# Altium project mb1367.PrjPcb (part 1 of 3)
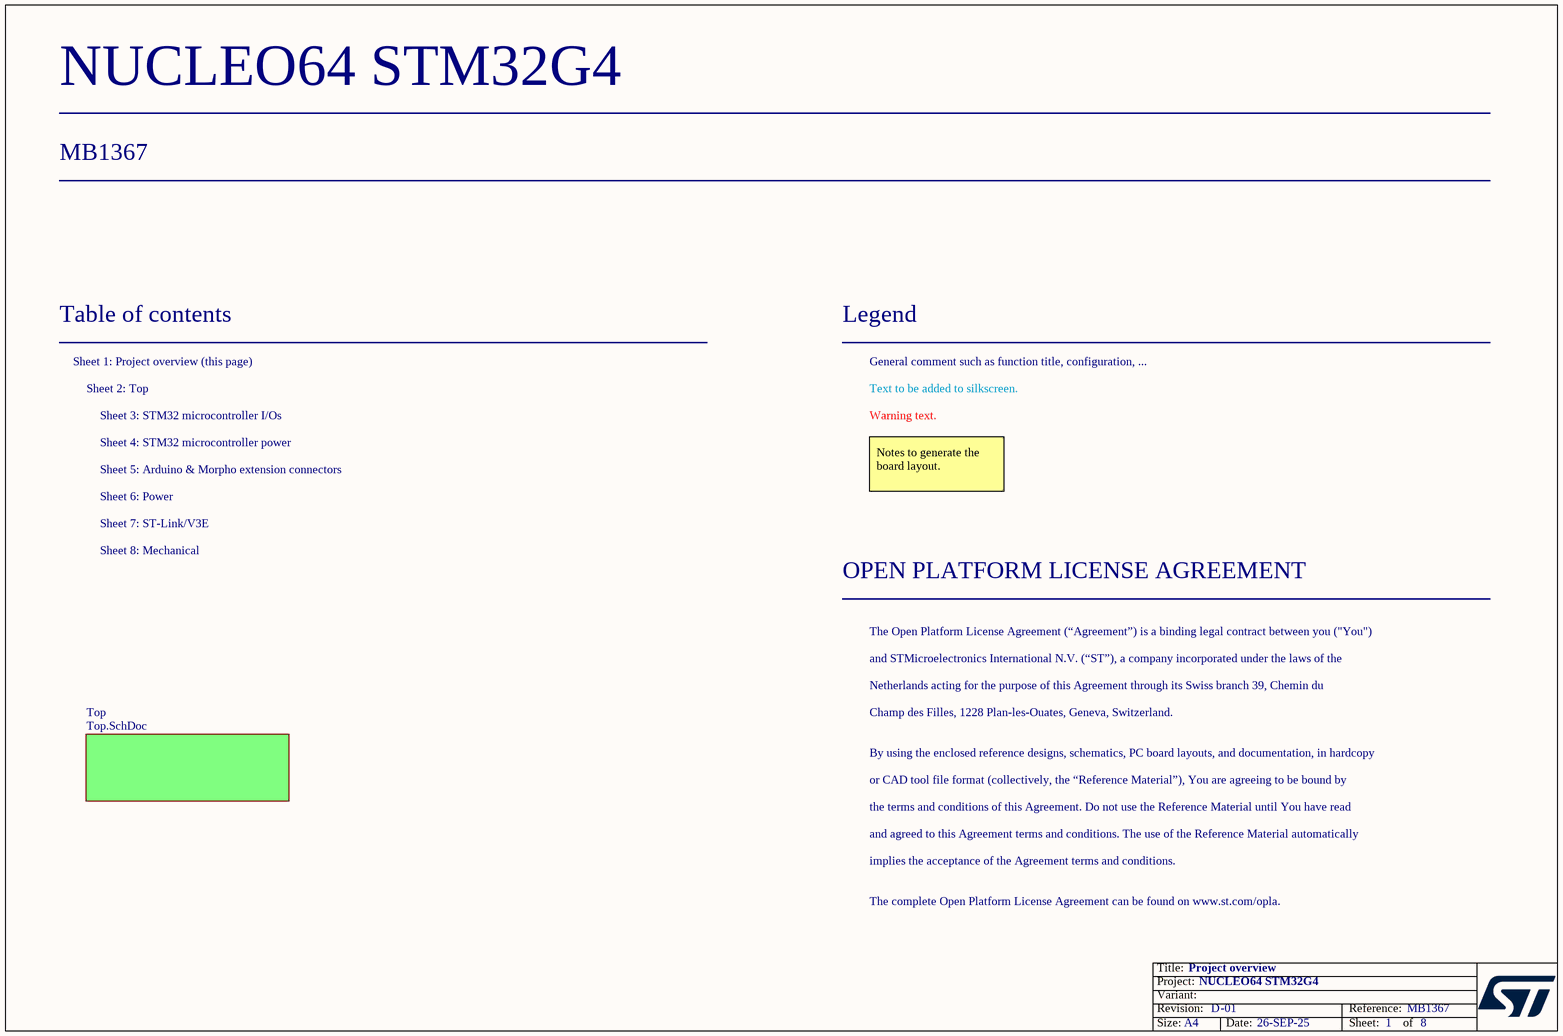
[diagram p0: Project_overview.SchDoc]
Board_Assembly_Revision: 01; Board_Document_Date: 26-SEP-25; Board_Name: NUCLEO64 STM32G4; Board_PCB_Revision: D; Board_Reference: MB1367
8 sheets, 202 parts. Net scope: flat (ports and power ports of the same name join across sheets).
Board file: MB1367.PcbDoc
Sheets:
  Project_overview.SchDoc
    Top = Top.SchDoc
      U_Arduino_extension_connectors = Arduino_extension_connectors.SchDoc
      U_Power = Power.SchDoc
      U_STM32_microcontroller_IOs = STM32_microcontroller_IOs.SchDoc
      U_STM32_microcontroller_power = STM32_microcontroller_power.SchDoc
      U_ST_LINK_V3E = ST_LINK_V3E.SchDoc
      Mechanical = Mechanical.SchDoc

## Sheet Project_overview.SchDoc: Project overview
size A4; Date: Not used; ApprovedBy: Not used; CheckedBy: Not used; Author: Not used; CompanyName: STMicroelectronics; DrawnBy: Not used; Engineer: Not used; Organization: Not used; Address1: Not used; Address2: Not used; Address3: Not used; Address4: Not used; DocumentNumber: 1; Revision: Not used; SheetNumber: 1; SheetTotal: 8; CurrentTime: Not used; CurrentDate: Not used; Time: Not used; DocumentFullPathAndName: Not used; DocumentName: Not used; ModifiedDate: Not used; ImagePath: Not used; ProjectName: Not used; Application_BuildNumber: Not used

### Sub-sheets
Top = Top.SchDoc: no entries

### Notes on the sheet
- Table of contents
- Sheet 1: Project overview (this page)
- Legend
- General comment such as function title, configuration, ...
- Sheet 2: Top
- Sheet 4: STM32 microcontroller power
- Sheet 3: STM32 microcontroller I/Os
- Text to be added to silkscreen.
- Warning text.
- Sheet 6: Power
- Sheet 5: Arduino & Morpho extension connectors
- Notes to generate the board layout.
- Sheet 7: ST-Link/V3E
- Sheet 8: Mechanical
- OPEN PLATFORM LICENSE AGREEMENT
- The Open Platform License Agreement (“Agreement”) is a binding legal contract between you ("You")
- and STMicroelectronics International N.V. (“ST”), a company incorporated under the laws of the
- Netherlands acting for the purpose of this Agreement through its Swiss branch 39, Chemin du
- Champ des Filles, 1228 Plan-les-Ouates, Geneva, Switzerland.
- By using the enclosed reference designs, schematics, PC board layouts, and documentation, in hardcopy
- or CAD tool file format (collectively, the “Reference Material”), You are agreeing to be bound by
- the terms and conditions of this Agreement. Do not use the Reference Material until You have read
- and agreed to this Agreement terms and conditions. The use of the Reference Material automatically
- implies the acceptance of the Agreement terms and conditions.
- The complete Open Platform License Agreement can be found on www.st.com/opla.
- Title:
- Project:
- Size:
- Revision:
- Variant:
- A4
- -
- Date:
- Reference:
- Sheet:
- of

## Sheet Top.SchDoc: Top hierarchical view
size A4; Date: Not used; ApprovedBy: Not used; CheckedBy: Not used; Author: Not used; CompanyName: STMicroelectronics; DrawnBy: Not used; Engineer: Not used; Organization: Not used; Address1: Not used; Address2: Not used; Address3: Not used; Address4: Not used; DocumentNumber: 2; Revision: A-01-P3; SheetNumber: 2; SheetTotal: 8; CurrentTime: Not used; CurrentDate: Not used; Time: Not used; DocumentFullPathAndName: Not used; DocumentName: Not used; ModifiedDate: Not used; ImagePath: Not used; ProjectName: Not used; Application_BuildNumber: Not used
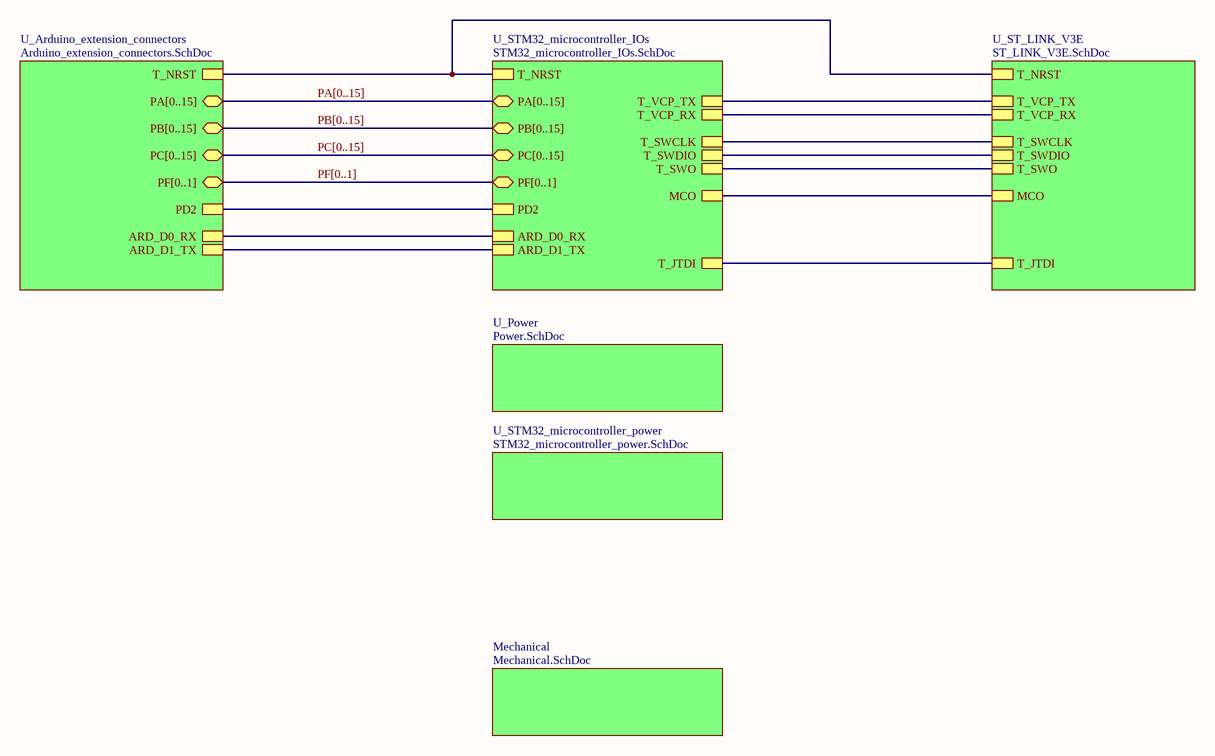
[diagram p1: Top.SchDoc]

### Sub-sheets
Mechanical = Mechanical.SchDoc: no entries
U_Arduino_extension_connectors = Arduino_extension_connectors.SchDoc: PA[0..15] (bidir), PB[0..15] (bidir), PC[0..15] (bidir), PD2, PF[0..1] (bidir), ARD_D0_RX, ARD_D1_TX, T_NRST
U_Power = Power.SchDoc: no entries
U_ST_LINK_V3E = ST_LINK_V3E.SchDoc: T_SWCLK, T_SWO, T_NRST, MCO, T_SWDIO, T_VCP_TX, T_VCP_RX, T_JTDI
U_STM32_microcontroller_IOs = STM32_microcontroller_IOs.SchDoc: PA[0..15] (bidir), PB[0..15] (bidir), PC[0..15] (bidir), PF[0..1] (bidir), ARD_D0_RX, ARD_D1_TX, MCO, PD2, T_NRST, T_VCP_TX, T_VCP_RX, T_SWCLK, T_SWO, T_SWDIO, T_JTDI
U_STM32_microcontroller_power = STM32_microcontroller_power.SchDoc: no entries

### Nets
(unnamed): sheet U_Arduino_extension_connectors/PD2, sheet U_STM32_microcontroller_IOs/PD2
(unnamed): sheet U_Arduino_extension_connectors/ARD_D0_RX, sheet U_STM32_microcontroller_IOs/ARD_D0_RX
(unnamed): sheet U_Arduino_extension_connectors/ARD_D1_TX, sheet U_STM32_microcontroller_IOs/ARD_D1_TX
(unnamed): sheet U_Arduino_extension_connectors/T_NRST, sheet U_STM32_microcontroller_IOs/T_NRST, sheet U_ST_LINK_V3E/T_NRST
(unnamed): sheet U_STM32_microcontroller_IOs/MCO, sheet U_ST_LINK_V3E/MCO
(unnamed): sheet U_STM32_microcontroller_IOs/T_VCP_TX, sheet U_ST_LINK_V3E/T_VCP_TX
(unnamed): sheet U_STM32_microcontroller_IOs/T_VCP_RX, sheet U_ST_LINK_V3E/T_VCP_RX
(unnamed): sheet U_STM32_microcontroller_IOs/T_SWCLK, sheet U_ST_LINK_V3E/T_SWCLK
(unnamed): sheet U_STM32_microcontroller_IOs/T_SWO, sheet U_ST_LINK_V3E/T_SWO
(unnamed): sheet U_STM32_microcontroller_IOs/T_SWDIO, sheet U_ST_LINK_V3E/T_SWDIO
(unnamed): sheet U_STM32_microcontroller_IOs/T_JTDI, sheet U_ST_LINK_V3E/T_JTDI

### Buses and harness runs
bus PA[0..15] = sheet U_Arduino_extension_connectors/PA[0..15] = sheet U_STM32_microcontroller_IOs/PA[0..15]
bus PB[0..15] = sheet U_Arduino_extension_connectors/PB[0..15] = sheet U_STM32_microcontroller_IOs/PB[0..15]
bus PC[0..15] = sheet U_Arduino_extension_connectors/PC[0..15] = sheet U_STM32_microcontroller_IOs/PC[0..15]
bus PF[0..1] = sheet U_Arduino_extension_connectors/PF[0..1] = sheet U_STM32_microcontroller_IOs/PF[0..1]

### Notes on the sheet
- Cuttable part on PCB
- Title:
- Project:
- Size:
- Revision:
- Variant:
- A4
- -
- Date:
- Reference:
- Sheet:
- of

## Sheet Arduino_extension_connectors.SchDoc: Arduino & Morpho extension connectors
size A4; Date: Not used; ApprovedBy: Not used; CheckedBy: Not used; Author: Not used; CompanyName: STMicroelectronics; DrawnBy: Not used; Engineer: Not used; Organization: Not used; Address1: Not used; Address2: Not used; Address3: Not used; Address4: Not used; DocumentNumber: 5; Revision: Not used; SheetNumber: 5; SheetTotal: 8; CurrentTime: Not used; CurrentDate: Not used; Time: Not used; DocumentFullPathAndName: Not used; DocumentName: Not used; ModifiedDate: Not used; ImagePath: Not used; ProjectName: Not used; Application_BuildNumber: Not used
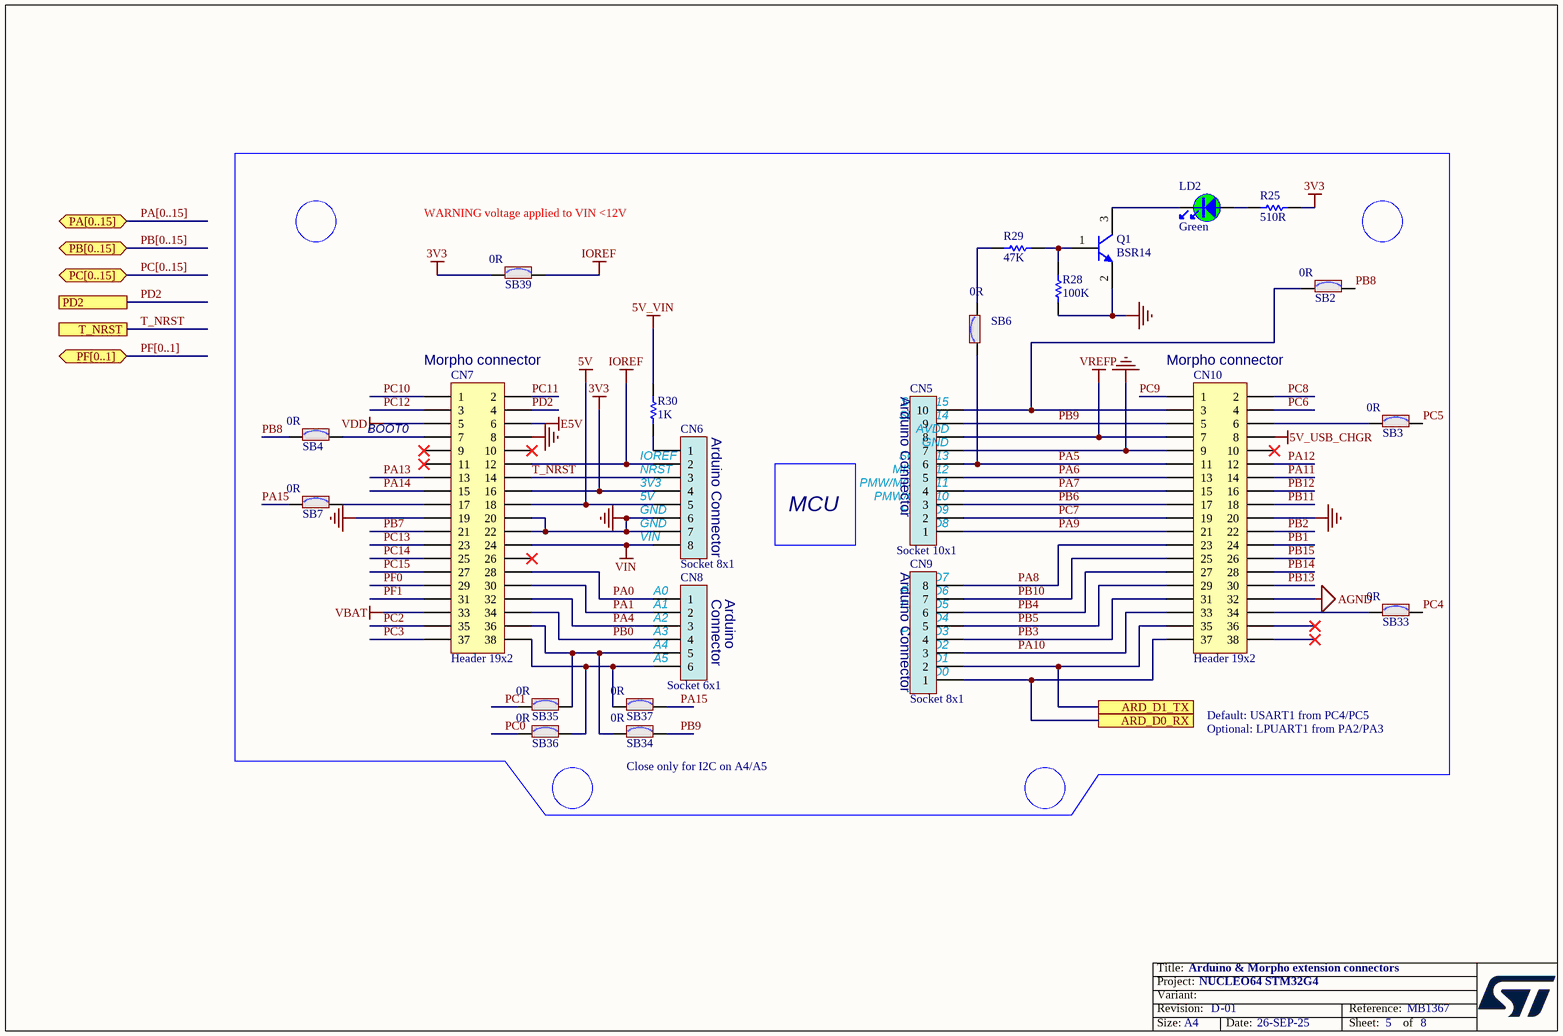
[diagram p2: Arduino_extension_connectors.SchDoc]

### Parts
CN5  value Socket 10x1  [CON_SAMTEC_SSW-110-03-X-S]
CN6  value Socket 8x1  [CON_SAMTEC_SSW-108-03-X-S]
CN7  value Header 19x2  [CON_SAMTEC_TSW-119-09-X-D]
CN8  value Socket 6x1  [CON_SAMTEC_SSW-106-03-X-S]
CN9  value Socket 8x1  [CON_SAMTEC_SSW-108-03-X-S]
CN10  value Header 19x2  [CON_SAMTEC_TSW-119-09-X-D]
LD2  value Green  [LED_0603_GREEN]  (hidden comment: LED_green)
Q1  value BSR14  [NPN_SOT23]
R25  value 510R  [R0603]
R28  value 100K  [R0603]
R29  value 47K  [R0603]
R30  value 1K  [R0603]
SB2  value 0R  [SOLDER-BRIDGE_R0603-0R]
SB3  value 0R  [SOLDER-BRIDGE_R0603-0R]
SB4  value 0R  [SOLDER-BRIDGE_R0603-0R]
SB6  value 0R  [SOLDER-BRIDGE_R0603-0R]
SB7  value 0R  [SOLDER-BRIDGE_R0603-0R]
SB33  value 0R  [SOLDER-BRIDGE_R0603-0R]
SB34  value 0R  [SOLDER-BRIDGE_R0603-0R]
SB35  value 0R  [SOLDER-BRIDGE_R0603-0R]
SB36  value 0R  [SOLDER-BRIDGE_R0603-0R]
SB37  value 0R  [SOLDER-BRIDGE_R0603-0R]
SB39  value 0R  [SOLDER-BRIDGE_R0603-0R]

### Ports
ARD_D0_RX, ARD_D1_TX, PA[0..15] (bidir), PB[0..15] (bidir), PC[0..15] (bidir), PD2, PF[0..1] (bidir), T_NRST

### Nets
3V3: CN6.4 CN7.16 R25.1 SB39.1
5V: CN6.5 CN7.18
5V_USB_CHGR: CN10.8
5V_VIN: R30.2
AGND: CN10.32
E5V: CN7.6
GND: CN5.7 CN6.6 CN6.7 CN7.8 CN7.19 CN7.20 CN7.22 CN10.9 CN10.20 Q1.2(E) R28.1
IOREF: CN6.2 CN7.12 SB39.2
VBAT: CN7.33
VDD: CN7.5
VIN: CN6.8 CN7.24
VREFP: CN5.8 CN10.7
ARD_D0_RX: CN9.1 CN10.37 ; port ARD_D0_RX
ARD_D1_TX: CN9.2 CN10.35 ; port ARD_D1_TX
PA0: CN7.28 CN8.1
PA1: CN7.30 CN8.2
PA4: CN7.32 CN8.3
PA5: CN5.6 CN10.11 SB6.1
PA6: CN5.5 CN10.13
PA7: CN5.4 CN10.15
PA8: CN9.8 CN10.23
PA9: CN5.1 CN10.21
PA10: CN9.3 CN10.33
PA11: CN10.14
PA12: CN10.12
PA13: CN7.13
PA14: CN7.15
PA15: SB7.1 SB37.2
PB0: CN7.34 CN8.4
PB1: CN10.24
PB2: CN10.22
PB3: CN9.4 CN10.31
PB4: CN9.6 CN10.27
PB5: CN9.5 CN10.29
PB6: CN5.3 CN10.17
PB7: CN7.21
PB8: SB2.2 SB4.1
PB9: CN5.9 CN10.5 SB34.2
PB10: CN9.7 CN10.25
PB11: CN10.18
PB12: CN10.16
PB13: CN10.30
PB14: CN10.28
PB15: CN10.26
PC0: SB36.1
PC1: SB35.1
PC2: CN7.35
PC3: CN7.37
PC4: SB33.2
PC5: SB3.2
PC6: CN10.4
PC7: CN5.2 CN10.19
PC8: CN10.2
PC9: CN10.1
PC10: CN7.1
PC11: CN7.2
PC12: CN7.3
PC13: CN7.23
PC14: CN7.25
PC15: CN7.27
PD2: CN7.4 ; port PD2
PF0: CN7.29
PF1: CN7.31
T_NRST: CN6.3 CN7.14 ; port T_NRST
NetCN5_10: CN5.10 CN10.3 SB2.1
NetCN6_1: CN6.1 R30.1
NetCN7_7: CN7.7 SB4.2
NetCN7_17: CN7.17 SB7.2
NetCN7_36: CN7.36 CN8.5 SB34.1 SB35.2
NetCN7_38: CN7.38 CN8.6 SB36.2 SB37.1
NetCN10_6: CN10.6 SB3.1
NetCN10_34: CN10.34 SB33.1
NetLD2_1: LD2.1 R25.2
NetLD2_2: LD2.2 Q1.3(C)
NetQ1_1: Q1.1(B) R28.2 R29.2
NetR29_1: R29.1 SB6.2

Not connected (* = marked no-connect by the designer): CN7 9* 10* 11* 26*; CN10 10* 36* 38*

### Buses and harness runs
bus PA[0..15] = port PA[0..15]
bus PB[0..15] = port PB[0..15]
bus PC[0..15] = port PC[0..15]
bus PF[0..1] = port PF[0..1]

### Notes on the sheet
- WARNING voltage applied to VIN <12V
- (near CN7) Morpho connector
- (near CN10) Morpho connector
- (near CN7) BOOT0
- (near CN6) Arduino Connector
- (near CN5) Arduino Connector
- (near CN5) SDA/D14
- (near CN5) SCL/D15
- (near CN5) AVDD
- (near CN5) GND
- (near CN6) GND
- (near CN6) 5V
- (near CN6) 3V3
- (near CN6) NRST
- (near CN6) IOREF
- MCU
- (near CN5) PMW/D9
- (near CN5) PMW/CS/D10
- (near CN5) SCK/D13
- (near CN5) MISO/D12
- (near CN5) PMW/MOSI/D11
- (near CN6) VIN
- (near CN9) Arduino Connector
- (near CN9) D7
- (near CN5) D8
- (near CN8) A0
- (near CN8) A1
- (near CN8) A2
- (near CN8) A3
- (near CN8) A4
- (near CN8) Connector
- (near CN8) Arduino
- (near CN9) D2
- (near CN9) D4
- (near CN9) PMW/D3
- (near CN9) PMW/D5
- (near CN9) PMW/D6
- (near CN8) A5
- (near CN9) RX/D0
- (near CN9) TX/D1
- (near SB34) Close only for I2C on A4/A5
- Default: USART1 from PC4/PC5
  Optional: LPUART1 from PA2/PA3
- Title:
- Project:
- Size:
- Revision:
- Variant:
- -
- Date:
- Reference:
- Sheet:
- of

### Library data of the parts
CN5 = MCD-00262: Socket, 10x1, 2.54mm, VR, TH, Height 8.51mm/10mm; Manufacturer_Part_Number: SSW-110-03-G-S; Manufacturer: SAMTEC; Part_Type: Connector; Full_Alternate_Internal_Part_Number: MCD-02397; Part_Preference: Recommended; Provided_By: SUBCO; Component_Country_Of_Origin: China, Costa Rica, Malaysia, USA, Vietnam; ID: 2609; Order_Code_RS: 207-9189; ShowFields: YES; Internal_Part_Number: MCD-00262; ECCN_US: n/a; ECCN_EU: n/a; ComponentLink1Description: Datasheet; Status: Released; ComponentLink1URL: http://tunmcdsvn.tun.st.com/Component_Documentation_Library/Trunk/Connector/SAMTEC_SSW-SSQ(TH)_Series/; Order_Code_Digikey: SSW-110-03-G-S-ND; Order_Code_Farnell: 3661270
CN6 CN9 = MCD-00261: Socket, 8x1, 2.54mm, VR, TH, Height 8.51mm/10mm; Manufacturer_Part_Number: SSW-108-03-G-S; Manufacturer: SAMTEC; Part_Type: Connector; Part_Preference: Recommended; Partial_Alternate_Internal_Part_Number: MCD-02396; Provided_By: SUBCO; Component_Country_Of_Origin: China, Costa Rica, Malaysia, USA, Vietnam; ID: 2607; ShowFields: YES; Internal_Part_Number: MCD-00261; ECCN_US: n/a; ECCN_EU: n/a; ComponentLink1Description: Datasheet; Status: Released; ComponentLink1URL: http://tunmcdsvn.tun.st.com/Component_Documentation_Library/Trunk/Connector/SAMTEC_SSW-SSQ(TH)_Series/; Order_Code_Digikey: SSW-108-03-G-S-ND; Order_Code_Farnell: N/A; Order_Code_RS: N/A
CN7 CN10 = MCD-00213: Header, 19x2, 2,54mm, VR, TH, Height 5.84mm/10.16mm; Manufacturer_Part_Number: TSW-119-09-G-D; Manufacturer: SAMTEC; Part_Type: Connector; Part_Preference: Recommended; Partial_Alternate_Internal_Part_Number: MCD-00213, MCD-02394, MCD-03736, MCD-03787, MCD-03997, MCD-04171, MCD-04274; Provided_By: SUBCO; Component_Country_Of_Origin: China, Costa Rica, Malaysia, USA, Vietnam; ID: 2656; ShowFields: YES; Internal_Part_Number: MCD-00213; ECCN_US: n/a; ECCN_EU: n/a; ComponentLink1Description: Datasheet; Status: Released; ComponentLink1URL: http://tunmcdsvn.tun.st.com/Component_Documentation_Library/Trunk/Connector/SAMTEC_TSW_Series; Order_Code_Digikey: TSW-119-09-G-D-ND; Order_Code_Farnell: 3664236; Order_Code_RS: N/A
CN8 = MCD-00260: Socket, 6x1, 2.54mm, VR, TH, Height 8.51mm/10mm; Manufacturer_Part_Number: SSW-106-03-G-S; Manufacturer: SAMTEC; Part_Type: Connector; Part_Preference: Recommended; Partial_Alternate_Internal_Part_Number: MCD-02395; Provided_By: SUBCO; Component_Country_Of_Origin: China, Costa Rica, Malaysia, USA, Vietnam; ID: 2606; ShowFields: YES; Internal_Part_Number: MCD-00260; ECCN_US: n/a; ECCN_EU: n/a; ComponentLink1Description: Datasheet; Status: Released; ComponentLink1URL: http://tunmcdsvn.tun.st.com/Component_Documentation_Library/Trunk/Connector/SAMTEC_SSW-SSQ(TH)_Series/; Order_Code_Digikey: SSW-106-03-G-S-ND; Order_Code_Farnell: N/A; Order_Code_RS: N/A
LD2 = MCD-02900: LED, Green, 2V, 20mA, 0603; Part_Type: Display; Part_Preference: Recommended; Manufacturer: EVERLIGHT; Manufacturer_Part_Number: 19-213SYGC/S530-E2/5T; Full_Alternate_Internal_Part_Number: MCD-00320; Partial_Alternate_Internal_Part_Number: MCD-00050; ShowFields: YES; ID: 5016; Component_Country_Of_Origin: China; Internal_Part_Number: MCD-02900; Status: Released; Package: 0603; ComponentLink1URL: http://tunmcdsvn.tun.st.com/Component_Documentation_Library/Trunk/Display/EVERLIGHT_19-213SYGC-S530-E2-5T; Order_Code_Digikey: 1080-19-213SYGC/S530-E2/5TTR-ND; Order_Code_Farnell: N/A; Order_Code_RS: N/A
Q1 = MCD-00073: NPN Bipolar Transistor; Manufacturer: ON SEMICONDUCTOR; Alternate_Manufacturer_Part_Number: MMBT2222LT1G / MMBT2222ALT1G / MMBT2222ALT3G; Part_Preference: Recommended; Partial_Alternate_Internal_Part_Number: MCD-01737, MCD-03305, MCD-02988; ECCN_US: EAR99; ECCN_EU: NEC; Provided_By: SUBCO; Component_Country_Of_Origin: Unknown; ID: 2519; ShowFields: YES; Revision: *; Internal_Part_Number: MCD-00073; Status: Released; Part_Type: Transistor; Manufacturer_Part_Number: BSR14; ComponentLink1Description: Datasheet; ComponentLink1URL: http://tunmcdsvn.tun.st.com/Component_Documentation_Library/Trunk/IC/ON_SEMICONDUCTOR_BSR14; Alternate_Manufacturer: ON SEMICONDUCTOR; Package: SOT-23; Order_Code_Digikey: N/A; Order_Code_Farnell: N/A; Order_Code_RS: N/A
R25 = MCD-00225: Resistor,510R,0603,1%,1/10W; Manufacturer_Part_Number: RC0603FR-07510RL; Manufacturer: YAGEO; Part_Preference: Recommended; ECCN_US: EAR99; ECCN_EU: NEC; Provided_By: SUBCO; Component_Country_Of_Origin: China; ID: 2644; ShowFields: YES; Internal_Part_Number: MCD-00225; ComponentLink1Description: Datasheet; Status: Released; Part_Type: Resistor; Package: 0603; ComponentLink1URL: http://tunmcdsvn.tun.st.com/Component_Documentation_Library/Trunk/Resistor/YAGEO_RC_L_Series; Order_Code_Digikey: 311-510HRCT-ND; Order_Code_Farnell: 1799351; Order_Code_RS: N/A
R28 = MCD-00223: Resistor,100K,0603,1%,1/10W; Manufacturer_Part_Number: RC0603FR-07100KL; Manufacturer: YAGEO; Part_Preference: Recommended; Provided_By: Subcon; Initial_Board_Reference: MB1319; Component_Country_Of_Origin: China; ID: 2647; ShowFields: YES; Internal_Part_Number: MCD-00223; Status: Released; Part_Type: Resistor; ComponentLink1Description: Yageo_Resistor_RC0603-series.pdf; ECCN_US: n/a; ECCN_EU: n/a; Package: 0603; ComponentLink1URL: http://tunmcdsvn.tun.st.com/Component_Documentation_Library/Trunk/Resistor/YAGEO_RC_L_Series; Order_Code_Digikey: 311-100KHRTR-ND; Order_Code_Farnell: 2421851; Order_Code_RS: N/A
R29 = MCD-00222: Resistor,47K,0603,1%,1/10W; Manufacturer_Part_Number: RC0603FR-0747KL; Manufacturer: YAGEO; Part_Preference: Recommended; ECCN_US: EAR99; ECCN_EU: NEC; Provided_By: SUBCO; Component_Country_Of_Origin: China; ID: 2645; ShowFields: YES; Internal_Part_Number: MCD-00222; Status: Released; Part_Type: Resistor; ComponentLink1Description: Datasheet; Package: 0603; ComponentLink1URL: http://tunmcdsvn.tun.st.com/Component_Documentation_Library/Trunk/Resistor/YAGEO_RC_L_Series; Order_Code_Digikey: 311-47.0KHRCT-ND; Order_Code_Farnell: 9238689; Order_Code_RS: N/A
R30 = MCD-00070: Resistor,1K,0603,1%,1/10W; Manufacturer_Part_Number: RC0603FR-071KL; Manufacturer: YAGEO; Part_Preference: Recommended; Provided_By: Subcon; Initial_Board_Reference: MB1274; Component_Country_Of_Origin: China; ID: 2522; Order_Code_RS: 9238484RL; ShowFields: YES; Internal_Part_Number: MCD-00070; ComponentLink1Description: Yageo_Resistor_RC0603-series.pdf; ECCN_US: n/a; ECCN_EU: n/a; Status: Released; Part_Type: Resistor; Package: 0603; ComponentLink1URL: http://tunmcdsvn.tun.st.com/Component_Documentation_Library/Trunk/Resistor/YAGEO_RC_L_Series; Order_Code_Digikey: 311-1.00KHRCT-ND; Order_Code_Farnell: 9238484RL
SB2-SB4 SB6 SB7 SB33-SB37 SB39 = MCD-00071: Solder Bridge ON; Part_Type: Resistor; Manufacturer_Part_Number: RC0603JR-070RL; Manufacturer: YAGEO; Manufacturer_HQ_COO: Unknown; Part_Preference: Recommended; Provided_By: SUBCO; Component_Country_Of_Origin: China; ID: 2521; Order_Code_RS: 199-5647; ShowFields: YES; Internal_Part_Number: MCD-00071; ECCN_US: n/a; ECCN_EU: n/a; Status: Released; Package: 0603; ComponentLink1Description: Datasheet; ComponentLink1URL: http://tunmcdsvn.tun.st.com/Component_Documentation_Library/Trunk/Resistor/YAGEO_RC_Series; Order_Code_Digikey: 311-0.0GRTR-ND; Order_Code_Farnell: 2421846

## Sheet Power.SchDoc: Main power 5V / 3V3
size A4; Date: Not used; ApprovedBy: Not used; CheckedBy: Not used; Author: Not used; CompanyName: STMicroelectronics; DrawnBy: Not used; Engineer: Not used; Organization: Not used; Address1: Not used; Address2: Not used; Address3: Not used; Address4: Not used; DocumentNumber: 6; Revision: Not used; SheetNumber: 6; SheetTotal: 8; CurrentTime: Not used; CurrentDate: Not used; Time: Not used; DocumentFullPathAndName: Not used; DocumentName: Not used; ModifiedDate: Not used; ImagePath: Not used; ProjectName: Not used; Application_BuildNumber: Not used
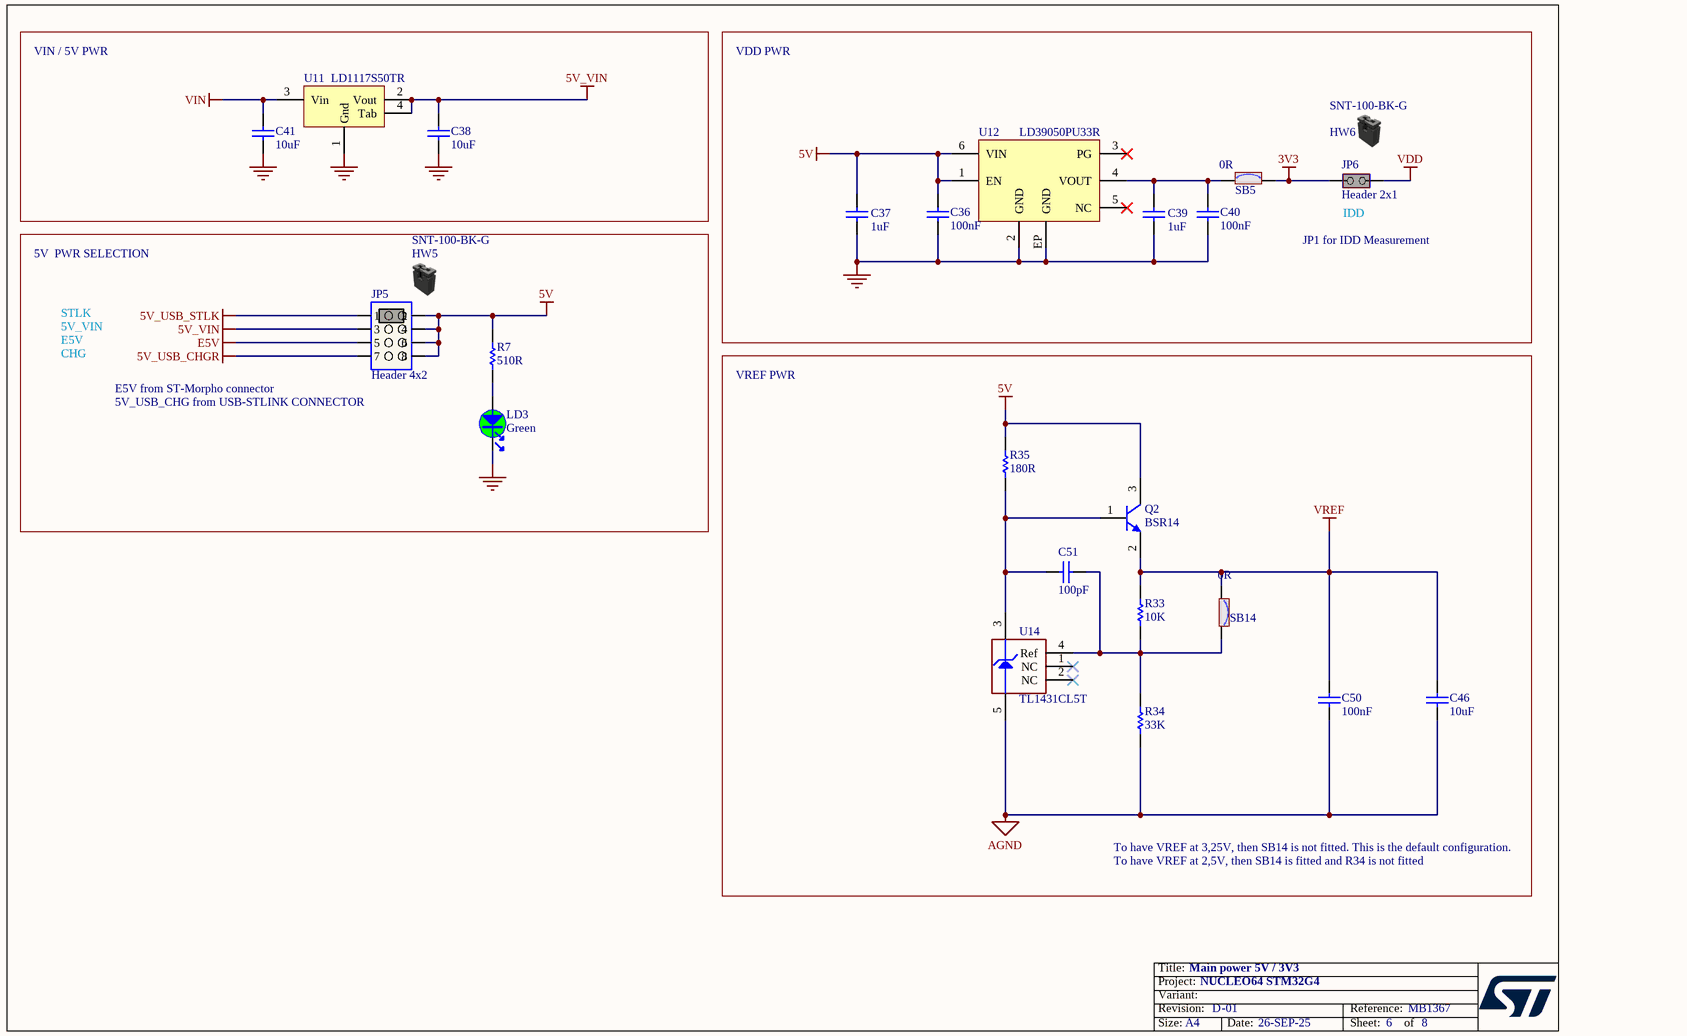
[diagram p3: Power.SchDoc]

### Parts
C36  value 100nF  [C0402]  (hidden comment: Capacitor)
C37  value 1uF  [C0603]
C38  value 10uF  [C0805]
C39  value 1uF  [C0603]
C40  value 100nF  [C0402]  (hidden comment: Capacitor)
C41  value 10uF  [C0805]
C46  value 10uF  [C0603]
C50  value 100nF  [C0603]
C51  value 100pF  [C0603]
HW5  value SNT-100-BK-G  (mechanical)
HW6  value SNT-100-BK-G  (mechanical)
JP5  value Header 4x2  [CON_SAMTEC_TSW-104-07-X-D]
JP6  value Header 2x1  [CON_SAMTEC_TSW-102-07-G-S]  (hidden comment: Shunt Fitted)
LD3  value Green  [LED_0603_GREEN]  (hidden comment: LED_green)
Q2  value BSR14  [NPN_SOT23]
R7  value 510R  [R0603]
R33  value 10K  [R0603]
R34  value 33K  [R0603]
R35  value 180R  [R0603]
SB5  value 0R  [SOLDER-BRIDGE_R0603-0R]
SB14  value 0R  [SOLDER-BRIDGE_R0603-0R]
U11  value LD1117S50TR  [REG_SOT223-TAB]
U12  value LD39050PU33R  [ICC_DFN6-EPAD_3X3_P095]
U14  value TL1431CL5T  [ICC_SOT23-5L_H1P45]

### Blocks framed on the sheet
VIN / 5V PWR: C38 C41 U11
VREF PWR: C46 C50 C51 Q2 R33-R35 SB14 U14

### Nets
3V3: JP6.1(COMMON) SB5.2
5V: C36.2 C37.2 JP5.2 JP5.4 JP5.6 JP5.8 Q2.3(C) R7.2 R35.2 U12.1(EN) U12.6(VIN)
5V_USB_CHGR: JP5.7
5V_USB_STLK: JP5.1
5V_VIN: C38.2 JP5.3 U11.2(Vout) U11.4(Tab)
AGND: C46.1 C50.1 R34.1 U14.5(Anode)
E5V: JP5.5
GND: C36.1 C37.1 C38.1 C39.1 C40.1 C41.1 LD3.2 U11.1(Gnd) U12.2(GND) U12.EP(GND)
VDD: JP6.2(NO)
VIN: C41.2 U11.3(Vin)
VREF: C46.2 C50.2 Q2.2(E) R33.2 SB14.1
NetC39_2: C39.2 C40.2 SB5.1 U12.4(VOUT)
NetC51_1: C51.1 Q2.1(B) R35.1 U14.3(Cathode)
NetC51_2: C51.2 R33.1 R34.2 SB14.2 U14.4(Ref)
NetLD3_1: LD3.1 R7.1

Not connected (* = marked no-connect by the designer): U12 3(PG)* 5(NC)*; U14 1(NC)* 2(NC)*

### Notes on the sheet
- VDD PWR
- JP1 for IDD Measurement
- (near JP6) IDD
- 5V  PWR SELECTION
- STLK
- E5V
- 5V_VIN
- CHG
- E5V from ST-Morpho connector
- 5V_USB_CHG from USB-STLINK CONNECTOR
- To have VREF at 3,25V, then SB14 is not fitted. This is the default configuration.
- To have VREF at 2,5V, then SB14 is fitted and R34 is not fitted
- Title:
- Project:
- Size:
- Revision:
- Variant:
- A4
- -
- Date:
- Reference:
- Sheet:
- of

### Library data of the parts
C36 C40 = MCD-00006: Capacitor, MLCC, 100nF, 16V, X7R, +/-10%, 0402, T=0.5mm; Manufacturer_Part_Number: CC0402KRX7R7BB104; Manufacturer: YAGEO; Part_Preference: Recommended; Partial_Alternate_Internal_Part_Number: MCD-03299; Order_Code_RS: 9402047; Component_Country_Of_Origin: China; ShowFields: YES; ID: 2474; Internal_Part_Number: MCD-00006; Status: Released; Package: 0402; Part_Type: Capacitor; ComponentLink1URL: http://tunmcdsvn.tun.st.com/Component_Documentation_Library/Trunk/Capacitor/YAGEO_X7R_Series; Order_Code_Digikey: 311-1338-1-ND; Order_Code_Farnell: 9402047
C37 C39 = MCD-00010: Capacitor, MLCC, 1uF, 16V, X5R, 10%, 0603, T=0,8mm; Manufacturer_Part_Number: CC0603KRX5R7BB105; Manufacturer: YAGEO; Part_Preference: Recommended; Provided_By: Subcon; Initial_Board_Reference: MB1274; Component_Country_Of_Origin: China; ID: 2470; Order_Code_RS: 2370680; ShowFields: YES; Internal_Part_Number: MCD-00010; Status: Released; Package: 0603; ComponentLink1Description: Yageo_Capacitor_X5R-series.pdf; ECCN_US: n/a; ECCN_EU: n/a; Part_Type: Capacitor; ComponentLink1URL: http://tunmcdsvn.tun.st.com/Component_Documentation_Library/Trunk/Capacitor/YAGEO_X5R_Series; Order_Code_Digikey: 311-1444-1-ND; Order_Code_Farnell: 2370680
C38 C41 = MCD-00014: Capacitor, MLCC, 10uF, 25V, X5R, 10%, 0805, T=0,85mm; Manufacturer_Part_Number: CC0805KRX5R8BB106; Manufacturer: YAGEO; Full_Alternate_Internal_Part_Number: MCD-02385; Part_Preference: Recommended; Partial_Alternate_Internal_Part_Number: MCD-03053; ECCN_US: EAR99; ECCN_EU: NEC; Provided_By: SUBCO; Component_Country_Of_Origin: China; ID: 2468; ShowFields: YES; Internal_Part_Number: MCD-00014; ComponentLink1Description: Datasheet; Status: Released; Part_Type: Capacitor; Package: 0805; ComponentLink1URL: http://tunmcdsvn.tun.st.com/Component_Documentation_Library/Trunk/Capacitor/YAGEO_X5R_Series; Order_Code_Digikey: 311-3503-1-ND; Order_Code_Farnell: N/A; Order_Code_RS: N/A
C46 = MCD-01124: Capacitor, MLCC, 10uF, 10V, X5R, 10%, 0603, T=0.8mm; Manufacturer_Part_Number: GRM188R61A106KAAL; Manufacturer: MURATA; Part_Preference: Recommended; Partial_Alternate_Internal_Part_Number: MCD-03152; ECCN_US: EAR99; ECCN_EU: NEC; Provided_By: SUBCO; Component_Country_Of_Origin: Japan°°; ID: 3372; Order_Code_RS: 170-6258; ShowFields: YES; Internal_Part_Number: MCD-01124; Status: Released; Part_Type: Capacitor; Package: 0603; ComponentLink1Description: Datasheet; ComponentLink1URL: http://tunmcdsvn.tun.st.com/Component_Documentation_Library/Trunk/Capacitor/MURATA_GRM_Series; Order_Code_Digikey: 490-12733-1-ND; Order_Code_Farnell: N/A
C50 = MCD-00211: Capacitor, MLCC, 100nF, 16V, X7R, 10%, 0603, T=0,8mm; Manufacturer_Part_Number: CC0603KRX7R7BB104; Manufacturer: YAGEO; Part_Preference: Recommended; Partial_Alternate_Internal_Part_Number: MCD-01099; ECCN_US: EAR99; ECCN_EU: NEC; Provided_By: SUBCO; Component_Country_Of_Origin: China; ID: 2659; Order_Code_RS: 669-8763; ShowFields: YES; Internal_Part_Number: MCD-00211; Status: Released; Part_Type: Capacitor; Package: 0603; ComponentLink1Description: Datasheet; ComponentLink1URL: http://tunmcdsvn.tun.st.com/Component_Documentation_Library/Trunk/Capacitor/YAGEO_X7R_Series; Order_Code_Digikey: 311-1088-1-ND; Order_Code_Farnell: 432210
C51 = MCD-01101: Capacitor,100pF,50V,X7R,10%,0603; Manufacturer_Part_Number: 06035C101JAT4A; Manufacturer: KYOCERA AVX; Part_Preference: Recommended; ECCN_US: EAR99; ECCN_EU: NEC; Provided_By: SUBCO; Component_Country_Of_Origin: China; ID: 3399; ShowFields: YES; Internal_Part_Number: MCD-01101; Status: Checked; Part_Type: Capacitor; Package: 0603; ComponentLink1Description: Datasheet; ComponentLink1URL: http://tunmcdsvn.tun.st.com/Component_Documentation_Library/Trunk/Capacitor/AVX_X7R_Series; Alternate_Manufacturer_Part_Number: N/A; Alternate_Manufacturer: N/A; Order_Code_Digikey: 06035C101JAT4A-ND; Order_Code_Farnell: 2332634; Order_Code_RS: N/A
HW5 HW6 = MCD-00043: SHUNT 2.54mm BLACK; Manufacturer: SAMTEC; Part_Type: Misc; Manufacturer_HQ_COO: Unknown; Part_Preference: Recommended; Partial_Alternate_Internal_Part_Number: MCD-01849, MCD-01864, MCD-02388, MCD-03991, MCD-04284, MCD-04580; Provided_By: Subcon; Initial_Board_Reference: MB1274; Alternate_EMS: A; Component_Country_Of_Origin: China, Costa Rica, Malaysia, USA, Vietnam; ID: 2551; Order_Code_RS: 158-7784; ShowFields: YES; Internal_Part_Number: MCD-00043; ECCN_US: n/a; ECCN_EU: n/a; Manufacturer_Part_Number: SNT-100-BK-G; ComponentLink1Description: Samtec_Shunt_Jumper_SNT100.pdf; Status: Released; ComponentLink1URL: http://tunmcdsvn.tun.st.com/Component_Documentation_Library/Trunk/Misc/SAMTEC_SNT-100-BK-G; Order_Code_Digikey: SAM8858-ND; Order_Code_Farnell: 2505007; Package: 2.54x5.08mm
JP5 = MCD-00686: Header, 4x2, 2,54mm, VR, TH, Height 5.84mm/2.54mm - Shunt Fitted 1-2; Part_Type: Connector; Manufacturer_Part_Number: TSW-104-07-G-D; Manufacturer: SAMTEC; Part_Preference: Recommended; Partial_Alternate_Internal_Part_Number: MCD-01661, MCD-03721, MCD-03993; Provided_By: SUBCO; Component_Country_Of_Origin: China, Costa Rica, Malaysia, USA, Vietnam; ID: 3062; Order_Code_RS: 161-2260; ShowFields: YES; Internal_Part_Number: MCD-00686; Status: Released; ComponentLink1Description: Datasheet; ComponentLink1URL: http://tunmcdsvn.tun.st.com/Component_Documentation_Library/Trunk/Connector/SAMTEC_TSW_Series; ECCN_US: n/a; ECCN_EU: n/a; Order_Code_Digikey: SAM1028-04-ND; Order_Code_Farnell: 2856692
JP6 = MCD-00683: Header, 2x1, 2,54mm, VR, TH, Height 5.84mm/2.54mm - Shunt Fitted by default; Part_Type: Connector; Manufacturer_Part_Number: TSW-102-07-G-S; Manufacturer: SAMTEC; Part_Preference: Recommended; Partial_Alternate_Internal_Part_Number: MCD-02389, MCD-02957, MCD-03720, MCD-03979, MCD-04463; Provided_By: Subcon; Initial_Board_Reference: MB1331; Component_Country_Of_Origin: China, Costa Rica, Malaysia, USA, Vietnam; ID: 3057; Order_Code_RS: 155-5312; ShowFields: YES; Internal_Part_Number: MCD-00683; Status: Released; ComponentLink1Description: Samtec_connector_TSW-HTSW-series.pdf; ComponentLink1URL: http://tunmcdsvn.tun.st.com/Component_Documentation_Library/Trunk/Connector/SAMTEC_TSW_Series; ECCN_US: n/a; ECCN_EU: n/a; Order_Code_Digikey: SAM1029-02-ND; Order_Code_Farnell: 2505044
LD3 = MCD-02900: as LD2 on sheet Arduino_extension_connectors; Internal_Part_Number: MCD-02900; Status: Released; Package: 0603; ComponentLink1URL: http://tunmcdsvn.tun.st.com/Component_Documentation_Library/Trunk/Display/EVERLIGHT_19-213SYGC-S530-E2-5T; Order_Code_Digikey: 1080-19-213SYGC/S530-E2/5TTR-ND; Order_Code_Farnell: N/A; Order_Code_RS: N/A
Q2 = MCD-00073: as Q1 on sheet Arduino_extension_connectors; Revision: *; Internal_Part_Number: MCD-00073; Status: Released; Part_Type: Transistor; Manufacturer_Part_Number: BSR14; ComponentLink1Description: Datasheet; ComponentLink1URL: http://tunmcdsvn.tun.st.com/Component_Documentation_Library/Trunk/IC/ON_SEMICONDUCTOR_BSR14; Alternate_Manufacturer: ON SEMICONDUCTOR; Package: SOT-23; Order_Code_Digikey: N/A; Order_Code_Farnell: N/A; Order_Code_RS: N/A
R7 = MCD-00225: as R25 on sheet Arduino_extension_connectors; Internal_Part_Number: MCD-00225; ComponentLink1Description: Datasheet; Status: Released; Part_Type: Resistor; Package: 0603; ComponentLink1URL: http://tunmcdsvn.tun.st.com/Component_Documentation_Library/Trunk/Resistor/YAGEO_RC_L_Series; Order_Code_Digikey: 311-510HRCT-ND; Order_Code_Farnell: 1799351; Order_Code_RS: N/A
R33 = MCD-01215: resistor, 10K, 0603, 0.5%, 1/10W; Manufacturer_Part_Number: RC0603DR-0710KL; Manufacturer: YAGEO; Part_Preference: Recommended; ECCN_US: EAR99; ECCN_EU: NEC; Provided_By: SUBCO; Component_Country_Of_Origin: China; ID: 3280; ShowFields: YES; Internal_Part_Number: MCD-01215; Status: Checked; Part_Type: Resistor; Package: 0603; ComponentLink1Description: Datasheet; ComponentLink1URL: http://tunmcdsvn.tun.st.com/Component_Documentation_Library/Trunk/Resistor/YAGEO_RC_L_Series; Order_Code_Digikey: RC0603DR-0710KL-ND; Order_Code_Farnell: N/A; Order_Code_RS: N/A
R34 = MCD-01209: Resistor,33K,0603,0.5%,1/10W; Manufacturer_Part_Number: RC0603DR-0733KL; Manufacturer: YAGEO; Part_Preference: Recommended; ECCN_US: EAR99; ECCN_EU: NEC; Provided_By: SUBCO; Component_Country_Of_Origin: China; ID: 3286; ShowFields: YES; Internal_Part_Number: MCD-01209; Status: Checked; Part_Type: Resistor; Package: 0603; ComponentLink1Description: Datasheet; ComponentLink1URL: http://tunmcdsvn.tun.st.com/Component_Documentation_Library/Trunk/Resistor/YAGEO_RC_L_Series; Order_Code_Digikey: RC0603DR-0733KL-ND; Order_Code_Farnell: N/A; Order_Code_RS: N/A
R35 = MCD-00342: Resistor,180R,0603,1%,1/10W; Manufacturer_Part_Number: RC0603FR-07180RL; Manufacturer: YAGEO; Part_Preference: Recommended; ECCN_US: EAR99; ECCN_EU: NEC; Provided_By: SUBCO; Component_Country_Of_Origin: China; ID: 2936; ShowFields: YES; Internal_Part_Number: MCD-00342; Status: Released; Part_Type: Resistor; Package: 0603; ComponentLink1Description: Datasheet; ComponentLink1URL: http://tunmcdsvn.tun.st.com/Component_Documentation_Library/Trunk/Resistor/YAGEO_RC_L_Series; Order_Code_Digikey: 311-180HRCT-ND; Order_Code_Farnell: 9238395; Order_Code_RS: N/A
SB5 SB14 = MCD-00071: as SB2 on sheet Arduino_extension_connectors; Internal_Part_Number: MCD-00071; ECCN_US: n/a; ECCN_EU: n/a; Status: Released; Package: 0603; ComponentLink1Description: Datasheet; ComponentLink1URL: http://tunmcdsvn.tun.st.com/Component_Documentation_Library/Trunk/Resistor/YAGEO_RC_Series; Order_Code_Digikey: 311-0.0GRTR-ND; Order_Code_Farnell: 2421846
U11 = MCD-00088: IC REG LDO 5V 0.8A SOT223; Manufacturer: STMICROELECTRONICS; BMS_Part_Number: 9176133; Manufacturer_HQ_COO: EU; Part_Preference: Recommended; ECCN_US: EAR99; ECCN_EU: NEC; Provided_By: SUBCO with ST control; Component_Country_Of_Origin: China; ID: 2503; Order_Code_RS: 165-7748; ShowFields: YES; Internal_Part_Number: MCD-00088; Manufacturer_Part_Number: LD1117S50TR; ComponentLink1Description: Datasheet; Status: Released; Part_Type: IC; ComponentLink1URL: http://tunmcdsvn.tun.st.com/Component_Documentation_Library/Trunk/IC/STMICROELECTRONICS_LD1117S50TR; Package: SOT223-4; Order_Code_Digikey: 497-6447-2-ND; Order_Code_Farnell: 1467781
U12 = MCD-00215: Low quiescent current and low noise voltage regulators; Manufacturer: STMICROELECTRONICS; Part_Type: IC; BMS_Part_Number: 9176126; Part_Preference: Recommended; ECCN_US: EAR99; ECCN_EU: NEC; Provided_By: SUBCO with ST control; Component_Country_Of_Origin: Malaysia; ID: 2654; Order_Code_RS: 196-1948; ShowFields: YES; Internal_Part_Number: MCD-00215; Manufacturer_Part_Number: LD39050PU33R; Status: Released; ComponentLink1Description: Datasheet; ComponentLink1URL: http://tunmcdsvn.tun.st.com/Component_Documentation_Library/Trunk/IC/STMICROELECTRONICS_LD39050PU33R; Package: DFN-6; Order_Code_Digikey: 497-8716-2-ND; Order_Code_Farnell: 2762703
U14 = MCD-01802: Programmable voltage reference with 0.4% voltage precision; Part_Type: IC; Manufacturer: STMICROELECTRONICS; BMS_Part_Number: 9176334; Manufacturer_HQ_COO: EU; Part_Preference: Recommended; ECCN_US: EAR99; ECCN_EU: NEC; Provided_By: SUBCO with ST control; Component_Country_Of_Origin: Malaysia; ID: 3902; ShowFields: YES; Internal_Part_Number: MCD-01802; Status: Released; Manufacturer_Part_Number: TL1431CL5T; Package: SOT23-5; ComponentLink1Description: Datasheet; ComponentLink1URL: http://tunmcdsvn.tun.st.com/Component_Documentation_Library/Trunk/IC/STMICROELECTRONICS_TL1431CL5T; Order_Code_Digikey: 497-16126-2-ND; Order_Code_Farnell: N/A; Order_Code_RS: N/A

## Sheet STM32_microcontroller_IOs.SchDoc: STM32 microcontroller I/Os
size A4; Date: Not used; ApprovedBy: Not used; CheckedBy: Not used; Author: Not used; CompanyName: STMicroelectronics; DrawnBy: Not used; Engineer: Not used; Organization: Not used; Address1: Not used; Address2: Not used; Address3: Not used; Address4: Not used; DocumentNumber: 3; Revision: Not used; SheetNumber: 3; SheetTotal: 8; CurrentTime: Not used; CurrentDate: Not used; Time: Not used; DocumentFullPathAndName: Not used; DocumentName: Not used; ModifiedDate: Not used; ImagePath: Not used; ProjectName: Not used; Application_BuildNumber: Not used
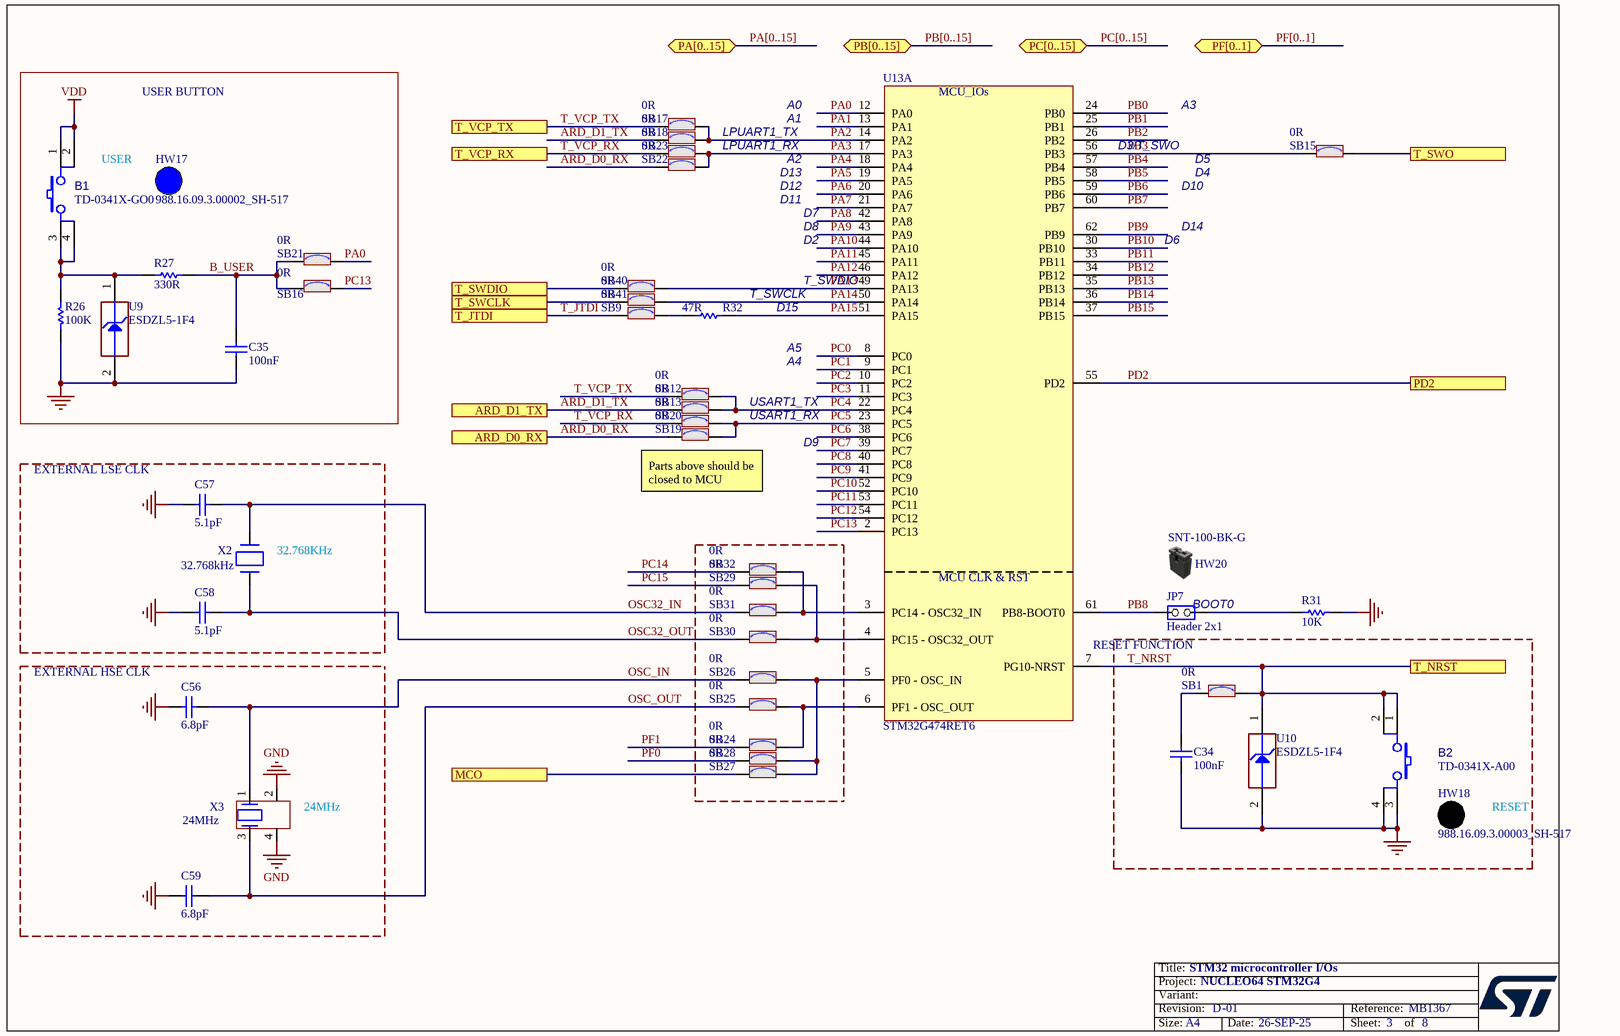
[diagram p4: STM32_microcontroller_IOs.SchDoc]

### Parts
B1  value TD-0341X-GO0  [SWI_WEALTHMETAL_TD-0341_4P_BLUE]
B2  value TD-0341X-A00  [SWI_WEALTHMETAL_TD-0341_4P_BLACK]
C34  value 100nF  [C0402]  (hidden comment: Capacitor)
C35  value 100nF  [C0402]  (hidden comment: Capacitor)
C56  value 6.8pF  [C0402]
C57  value 5.1pF  [C0402]
C58  value 5.1pF  [C0402]
C59  value 6.8pF  [C0402]
HW17  value 988.16.09.3.00002_SH-517  (mechanical)
HW18  value 988.16.09.3.00003_SH-517  (mechanical)
HW20  value SNT-100-BK-G  (mechanical)
JP7  value Header 2x1  [CON_SAMTEC_TSW-102-07-G-S]
R26  value 100K  [R0603]
R27  value 330R  [R0603]
R31  value 10K  [R0603]
R32  value 47R  [R0402]
SB1  value 0R  [SOLDER-BRIDGE_R0603-0R]
SB9  value 0R  [SOLDER-BRIDGE_R0603-0R]
SB12  value 0R  [SOLDER-BRIDGE_R0603-0R]
SB13  value 0R  [SOLDER-BRIDGE_R0603-0R]
SB15  value 0R  [SOLDER-BRIDGE_R0603-0R]
SB16  value 0R  [SOLDER-BRIDGE_R0603-0R]
SB17  value 0R  [SOLDER-BRIDGE_R0603-0R]
SB18  value 0R  [SOLDER-BRIDGE_R0603-0R]
SB19  value 0R  [SOLDER-BRIDGE_R0603-0R]
SB20  value 0R  [SOLDER-BRIDGE_R0603-0R]
SB21  value 0R  [SOLDER-BRIDGE_R0603-0R]
SB22  value 0R  [SOLDER-BRIDGE_R0603-0R]
SB23  value 0R  [SOLDER-BRIDGE_R0603-0R]
SB24  value 0R  [SOLDER-BRIDGE_R0603-0R]
SB25  value 0R  [SOLDER-BRIDGE_R0603-0R]
SB26  value 0R  [SOLDER-BRIDGE_R0603-0R]
SB27  value 0R  [SOLDER-BRIDGE_R0603-0R]
SB28  value 0R  [SOLDER-BRIDGE_R0603-0R]
SB29  value 0R  [SOLDER-BRIDGE_R0603-0R]
SB30  value 0R  [SOLDER-BRIDGE_R0603-0R]
SB31  value 0R  [SOLDER-BRIDGE_R0603-0R]
SB32  value 0R  [SOLDER-BRIDGE_R0603-0R]
SB40  value 0R  [SOLDER-BRIDGE_R0603-0R]
SB41  value 0R  [SOLDER-BRIDGE_R0603-0R]
U9  value ESDZL5-1F4  [ESD_0201_H0P3_1K_2A]  (hidden comment: ESD-TRANSIL)
U10  value ESDZL5-1F4  [ESD_0201_H0P3_1K_2A]  (hidden comment: ESD-TRANSIL)
U13  value STM32G474RET6  [ICC_LQFP64_10X10_P050_SOCKET_YAMAICHI_IC149-064-069-B5_NM]  (part A of 2)
X2  value 32.768kHz  [CRY_NX3215SA_2P]
X3  value 24MHz  [CRY_NX2016SA_4P]

### Ports
ARD_D0_RX, ARD_D1_TX, MCO, PA[0..15] (bidir), PB[0..15] (bidir), PC[0..15] (bidir), PD2, PF[0..1] (bidir), T_JTDI, T_NRST, T_SWCLK, T_SWDIO, T_SWO, T_VCP_RX, T_VCP_TX

### Nets
GND: B2.3 B2.4 C34.1 C35.1 C56.1 C57.2 C58.2 C59.1 R26.1 R31.1 U9.2(GND) U10.2(GND) X3.2 X3.4
VDD: B1.1 B1.2
ARD_D0_RX: SB19.2 SB22.2 ; port ARD_D0_RX
ARD_D1_TX: SB13.2 SB18.2 ; port ARD_D1_TX
B_USER: C35.2 R27.2 SB16.1 SB21.1
MCO: SB27.1 ; port MCO
OSC32_IN: C57.1 SB31.1 X2.1(X1)
OSC32_OUT: C58.1 SB30.1 X2.2(X2)
OSC_IN: C56.2 SB26.1 X3.1
OSC_OUT: C59.2 SB25.1 X3.3
PA0: SB21.2 U13.12(PA0)
PA1: U13.13(PA1)
PA2: SB17.2 SB18.1 U13.14(PA2)
PA3: SB22.1 SB23.2 U13.17(PA3)
PA4: U13.18(PA4)
PA5: U13.19(PA5)
PA6: U13.20(PA6)
PA7: U13.21(PA7)
PA8: U13.42(PA8)
PA9: U13.43(PA9)
PA10: U13.44(PA10)
PA11: U13.45(PA11)
PA12: U13.46(PA12)
PA13: SB40.2 U13.49(PA13)
PA14: SB41.2 U13.50(PA14)
PA15: R32.2 U13.51(PA15)
PB0: U13.24(PB0)
PB1: U13.25(PB1)
PB2: U13.26(PB2)
PB3: SB15.1 U13.56(PB3)
PB4: U13.57(PB4)
PB5: U13.58(PB5)
PB6: U13.59(PB6)
PB7: U13.60(PB7)
PB8: JP7.1(COMMON) U13.61(PB8-BOOT0)
PB9: U13.62(PB9)
PB10: U13.30(PB10)
PB11: U13.33(PB11)
PB12: U13.34(PB12)
PB13: U13.35(PB13)
PB14: U13.36(PB14)
PB15: U13.37(PB15)
PC0: U13.8(PC0)
PC1: U13.9(PC1)
PC2: U13.10(PC2)
PC3: U13.11(PC3)
PC4: SB12.2 SB13.1 U13.22(PC4)
PC5: SB19.1 SB20.2 U13.23(PC5)
PC6: U13.38(PC6)
PC7: U13.39(PC7)
PC8: U13.40(PC8)
PC9: U13.41(PC9)
PC10: U13.52(PC10)
PC11: U13.53(PC11)
PC12: U13.54(PC12)
PC13: SB16.2 U13.2(PC13)
PC14: SB32.1
PC15: SB29.1
PD2: U13.55(PD2) ; port PD2
PF0: SB28.1
PF1: SB24.1
T_JTDI: SB9.1 ; port T_JTDI
T_NRST: B2.1 B2.2 SB1.2 U10.1(IO1) U13.7(PG10-NRST) ; port T_NRST
T_SWCLK: SB41.1 ; port T_SWCLK
T_SWDIO: SB40.1 ; port T_SWDIO
T_SWO: SB15.2 ; port T_SWO
T_VCP_RX: SB20.1 SB23.1 ; port T_VCP_RX
T_VCP_TX: SB12.1 SB17.1 ; port T_VCP_TX
NetB1_3: B1.3 B1.4 R26.2 R27.1 U9.1(IO1)
NetC34_2: C34.2 SB1.1
NetJP7_2: JP7.2(NO) R31.2
NetR32_1: R32.1 SB9.2
NetSB24_2: SB24.2 SB25.2 U13.6(PF1_-_OSC_OUT)
NetSB26_2: SB26.2 SB27.2 SB28.2 U13.5(PF0_-_OSC_IN)
NetSB29_2: SB29.2 SB30.2 U13.4(PC15_-_OSC32_OUT)
NetSB31_2: SB31.2 SB32.2 U13.3(PC14_-_OSC32_IN)

### Buses and harness runs
bus PA[0..15] = port PA[0..15]
bus PB[0..15] = port PB[0..15]
bus PC[0..15] = port PC[0..15]
bus PF[0..1] = port PF[0..1]

### Notes on the sheet
- USER BUTTON
- A0
- A3
- USER
- LPUART1_TX
- LPUART1_RX
- A1
- A2
- D13
- D3/T_SWO
- D4
- D5
- D12
- D11
- D2
- D7
- D8
- D14
- D10
- D6
- (near R32) T_SWCLK
- D15
- (near R32) T_SWDIO
- A4
- A5
- USART1_RX
- USART1_TX
- D9
- EXTERNAL LSE CLK
- (near SB19) Parts above should be closed to MCU
- (near X2) 32.768KHz
- RESET FUNCTION
- BOOT0
- EXTERNAL HSE CLK
- (near X3) 24MHz
- RESET
- Title:
- Project:
- Size:
- Revision:
- Variant:
- -
- Date:
- Reference:
- Sheet:
- of
- (in symbol MCD-01243, part A) MCU_IOs; MCU CLK & RST

### Library data of the parts
B1 = MCD-00002: Non-Open Push-Button 0.1A 24V; Manufacturer: WEALTHMETAL; Part_Type: Misc; Part_Preference: Forbidden; Partial_Alternate_Internal_Part_Number: MCD-03589; Provided_By: SUBCO; Alternate_EMS: A; Component_Country_Of_Origin: Unknown; ID: 2464; ShowFields: YES; Internal_Part_Number: MCD-00002; ECCN_US: n/a; ECCN_EU: n/a; Manufacturer_Part_Number: TD-0341X-GO0; ComponentLink1Description: Datasheet; Status: Obsolete; ComponentLink1URL: http://tunmcdsvn.tun.st.com/Component_Documentation_Library/Trunk/Misc/WEALTHMETAL_TD-0341; Manufacturer_HQ_COO: Unknown; Order_Code_Digikey: N/A; Order_Code_Farnell: N/A; Order_Code_RS: N/A; Package: 6x10mm
B2 = MCD-00001: Non-Open Push-Button 0.1A 24V BLACK; Manufacturer: WEALTHMETAL; Part_Type: Misc; Part_Preference: Forbidden; Partial_Alternate_Internal_Part_Number: MCD-03587; Provided_By: SUBCO; Alternate_EMS: A; Component_Country_Of_Origin: Unknown; ID: 2463; ShowFields: YES; Internal_Part_Number: MCD-00001; ECCN_US: n/a; ECCN_EU: n/a; Manufacturer_Part_Number: TD-0341X-A00; ComponentLink1Description: Datasheet; Status: Obsolete; ComponentLink1URL: http://tunmcdsvn.tun.st.com/Component_Documentation_Library/Trunk/Misc/WEALTHMETAL_TD-0341; Order_Code_Digikey: N/A; Order_Code_Farnell: N/A; Order_Code_RS: N/A; Package: 6x10mm
C34 C35 = MCD-00006: as C36 on sheet Power; Internal_Part_Number: MCD-00006; Status: Released; Package: 0402; Part_Type: Capacitor; ComponentLink1URL: http://tunmcdsvn.tun.st.com/Component_Documentation_Library/Trunk/Capacitor/YAGEO_X7R_Series; Order_Code_Digikey: 311-1338-1-ND; Order_Code_Farnell: 9402047
C56 C59 = MCD-00674: Capacitor, MLCC, 6.8pF, 50V, NPO, +-0.25pF, 0402, T=0.5mm; Manufacturer_Part_Number: CC0402CRNPO9BN6R8; Manufacturer: YAGEO; Part_Preference: Recommended; Provided_By: SUBCO; Component_Country_Of_Origin: China; ID: 3068; ShowFields: YES; Internal_Part_Number: MCD-00674; Status: Released; Part_Type: Capacitor; Package: 0402; ComponentLink1Description: Datasheet; ComponentLink1URL: http://tunmcdsvn.tun.st.com/Component_Documentation_Library/Trunk/Capacitor/YAGEO_NP0_Series; ECCN_US: N/A; ECCN_EU: N/A; Order_Code_Digikey: 311-3327-1-ND; Order_Code_Farnell: N/A; Order_Code_RS: N/A
C57 C58 = MCD-00003: Capacitor, MLCC, 5.1pF, 50V, NPO, +-0.25pF, 0402, T=0.5mm; Manufacturer_Part_Number: CC0402CRNPO9BN5R1; Manufacturer: YAGEO; Part_Preference: Recommended; ECCN_US: EAR99; ECCN_EU: NEC; Provided_By: SUBCO; Component_Country_Of_Origin: China; ID: 2477; ShowFields: YES; Internal_Part_Number: MCD-00003; ComponentLink1Description: Datasheet; Status: Released; Part_Type: Capacitor; Package: 0402; ComponentLink1URL: http://tunmcdsvn.tun.st.com/Component_Documentation_Library/Trunk/Capacitor/YAGEO_NP0_Series; Order_Code_Digikey: 311-1633-1-ND; Order_Code_Farnell: N/A; Order_Code_RS: N/A
HW17 = MCD-00634: Blue Hat for switch TD0341X-G01-BLU; Part_Type: Mechanical; Manufacturer: _A_JIUBABA; Part_Preference: Alternate; Provided_By: SUBCO; Alternate_EMS: A; Component_Country_Of_Origin: Unknown; ID: 3112; ShowFields: YES; Internal_Part_Number: MCD-00634; Status: Released; Manufacturer_Part_Number: 988.16.09.3.00002_SH-517; ECCN_US: n/a; ECCN_EU: n/a; ComponentLink1Description: Datasheet; ComponentLink1URL: http://tunmcdsvn.tun.st.com/Component_Documentation_Library/Trunk/Misc/JIUBABA_988.16.09.3.00002_SH-517; Manufacturer_HQ_COO: Unknown; Order_Code_Digikey: N/A; Order_Code_Farnell: N/A; Order_Code_RS: N/A; Package: diameter=4.5mm
HW18 = MCD-00635: Black Hat for switch TD0341X-G01-BLA; Part_Type: Mechanical; Manufacturer: _A_JIUBABA; Part_Preference: Alternate; Partial_Alternate_Internal_Part_Number: MCD-04574; Provided_By: SUBCO; Alternate_EMS: A; Component_Country_Of_Origin: Unknown; ID: 3106; ShowFields: YES; Internal_Part_Number: MCD-00635; Status: Released; Manufacturer_Part_Number: 988.16.09.3.00003_SH-517; ECCN_US: n/a; ECCN_EU: n/a; ComponentLink1Description: Datasheet; ComponentLink1URL: http://tunmcdsvn.tun.st.com/Component_Documentation_Library/Trunk/Misc/JIUBABA_988.16.09.3.00003_SH-517; Manufacturer_HQ_COO: Unknown; Order_Code_Digikey: N/A; Order_Code_Farnell: N/A; Order_Code_RS: N/A; Package: diameter=4.5mm
HW20 = MCD-00043: as HW5 on sheet Power; Internal_Part_Number: MCD-00043; ECCN_US: n/a; ECCN_EU: n/a; Manufacturer_Part_Number: SNT-100-BK-G; ComponentLink1Description: Samtec_Shunt_Jumper_SNT100.pdf; Status: Released; ComponentLink1URL: http://tunmcdsvn.tun.st.com/Component_Documentation_Library/Trunk/Misc/SAMTEC_SNT-100-BK-G; Order_Code_Digikey: SAM8858-ND; Order_Code_Farnell: 2505007; Package: 2.54x5.08mm
JP7 = MCD-00045: Header, 2x1, 2,54mm, VR, TH, Height 5.84mm/2.54mm; Part_Type: Connector; Manufacturer_Part_Number: TSW-102-07-G-S; Manufacturer: SAMTEC; Part_Preference: Recommended; Partial_Alternate_Internal_Part_Number: MCD-02389, MCD-02957, MCD-03720, MCD-03979, MCD-04249; Provided_By: Subcon; Initial_Board_Reference: MB1274; Component_Country_Of_Origin: China, Costa Rica, Malaysia, USA, Vietnam; ID: 2545; Order_Code_RS: 2505044; ShowFields: YES; Internal_Part_Number: MCD-00045; Status: Released; ComponentLink1Description: Samtec_connector_TSW-HTSW-series.pdf; ComponentLink1URL: http://tunmcdsvn.tun.st.com/Component_Documentation_Library/Trunk/Connector/SAMTEC_TSW_Series; ECCN_US: n/a; ECCN_EU: n/a; Order_Code_Digikey: SAM1029-02-ND; Order_Code_Farnell: 2505044
R26 = MCD-00223: as R28 on sheet Arduino_extension_connectors; Internal_Part_Number: MCD-00223; ECCN_US: n/a; ECCN_EU: n/a; ComponentLink1Description: Yageo_Resistor_RC0603-series.pdf; Status: Released; Part_Type: Resistor; Package: 0603; ComponentLink1URL: http://tunmcdsvn.tun.st.com/Component_Documentation_Library/Trunk/Resistor/YAGEO_RC_L_Series; Order_Code_Digikey: 311-100KHRTR-ND; Order_Code_Farnell: 2421851; Order_Code_RS: N/A
R27 = MCD-00197: Resistor,330R,0603,1%,1/10W; Manufacturer_Part_Number: RC0603FR-07330RL; Manufacturer: YAGEO; BMS_Part_Number: 9129729; Part_Preference: Recommended; Provided_By: Subcon; Component_Country_Of_Origin: China; ID: 2672; ShowFields: YES; Internal_Part_Number: MCD-00197; Status: Released; ComponentLink1Description: Yageo_Resistor_RC0603-series.pdf; ECCN_US: n/a; ECCN_EU: n/a; Part_Type: Resistor; Package: 0603; ComponentLink1URL: http://tunmcdsvn.tun.st.com/Component_Documentation_Library/Trunk/Resistor/YAGEO_RC_L_Series; Order_Code_Digikey: 311-330HRCT-ND; Order_Code_Farnell: 9238425; Order_Code_RS: N/A
R31 = MCD-00220: Resistor,10K,0603,1%,1/10W; Manufacturer_Part_Number: RC0603FR-0710KL; Manufacturer: YAGEO; Part_Preference: Recommended; Provided_By: Subcon; Initial_Board_Reference: MB1319; Component_Country_Of_Origin: China; ID: 2649; ShowFields: YES; Internal_Part_Number: MCD-00220; ECCN_US: n/a; ECCN_EU: n/a; ComponentLink1Description: Yageo_Resistor_RC0603-series.pdf; Status: Released; Part_Type: Resistor; Package: 0603; ComponentLink1URL: http://tunmcdsvn.tun.st.com/Component_Documentation_Library/Trunk/Resistor/YAGEO_RC_L_Series; Order_Code_Digikey: 311-10.0KHRCT-ND; Order_Code_Farnell: 9238603; Order_Code_RS: N/A
R32 = MCD-00481: Resistor,47R,0402,1%,1/16W; Manufacturer_Part_Number: RC0402FR-0747RL; Manufacturer: YAGEO; Part_Preference: Recommended; Provided_By: SUBCO; ECCN_US: EAR99; ECCN_EU: NEC; Component_Country_Of_Origin: China; ID: 2796; ShowFields: YES; Internal_Part_Number: MCD-00481; Status: Released; Part_Type: Resistor; Package: 0402; ComponentLink1Description: Datasheet; ComponentLink1URL: http://tunmcdsvn.tun.st.com/Component_Documentation_Library/Trunk/Resistor/YAGEO_RC_L_Series; Order_Code_Digikey: 311-47.0LRCT-ND; Order_Code_Farnell: 9239073; Order_Code_RS: N/A
SB1 SB9 SB12 SB13 SB15-SB32 SB40 SB41 = MCD-00071: as SB2 on sheet Arduino_extension_connectors; Internal_Part_Number: MCD-00071; ECCN_US: n/a; ECCN_EU: n/a; Status: Released; Package: 0603; ComponentLink1Description: Datasheet; ComponentLink1URL: http://tunmcdsvn.tun.st.com/Component_Documentation_Library/Trunk/Resistor/YAGEO_RC_Series; Order_Code_Digikey: 311-0.0GRTR-ND; Order_Code_Farnell: 2421846
U9 U10 = MCD-03501: Diode, ESD TVS, 5V5, 100nA, 10V, 0201; Manufacturer: STMICROELECTRONICS; Part_Preference: Recommended; Component_Country_Of_Origin: Singapore; ID: 5617; ShowFields: YES; Internal_Part_Number: MCD-03501; Status: Released; Part_Type: Diode; Manufacturer_Part_Number: ESDZL5-1F4; ComponentLink1URL: http://tunmcdsvn.tun.st.com/Component_Documentation_Library/Trunk/Diode/STMICROELECTRONICS_ESDZL5-1F4; Order_Code_Digikey: 497-17544-2-ND; Order_Code_Farnell: ESDZL5-1F4; Order_Code_RS: ESDZL5-1F4; Package: 0201
U13 = MCD-01243: STM32G474, LQFP64 package,  3D IC footprint with 2D socket footprint.; Manufacturer: STMICROELECTRONICS; BMS_Part_Number: 9175326; Manufacturer_HQ_COO: EU; Part_Preference: Recommended; Provided_By: SUBCO with ST control; ECCN_US: 3A991A2; ECCN_EU: NEC; Component_Country_Of_Origin: China; ID: 3257; Order_Code_RS: 193-9861; ShowFields: YES; Internal_Part_Number: MCD-01243; Status: Released; Part_Type: IC; Manufacturer_Part_Number: STM32G474RET6; Package: LQFP64; ComponentLink1Description: Datasheet; ComponentLink1URL: http://tunmcdsvn.tun.st.com/Component_Documentation_Library/Trunk/IC/STMICROELECTRONICS_STM32G474RET6; Order_Code_Digikey: 497-STM32G474RET6-ND; Order_Code_Farnell: 3132418
X2 = MCD-00091: Crystal 32.768kHz, 6pF, +-20ppm, 50Kohms max, SMD; Manufacturer_Part_Number: NX3215SA-32.768KHz-EXS00A-MU00525; Manufacturer: NDK; Part_Type: Crystal_Osc; BMS_Part_Number: 9157034; Part_Preference: Recommended; ECCN_US: EAR99; ECCN_EU: NEC; Provided_By: SUBCO; Component_Country_Of_Origin: Japan; ID: 2553; ShowFields: YES; Internal_Part_Number: MCD-00091; ComponentLink1Description: Datasheet; Status: Released; ComponentLink1URL: http://tunmcdsvn.tun.st.com/Component_Documentation_Library/Trunk/Crystal_Oscillator/NDK_NX3215SA_Series; Order_Code_Digikey: 644-1386; Order_Code_Farnell: N/A; Order_Code_RS: N/A; Package: 3.2x1.5mm
X3 = MCD-01036: Crystal 24MHz, 6pF, +-20ppm, 80ohms max, SMD; Part_Type: Crystal_Osc; Manufacturer_Part_Number: NX2016SA-24MHz-EXS00A-CS10820; Manufacturer: NDK; BMS_Part_Number: 9157045; Part_Preference: Recommended; ECCN_US: EAR99; ECCN_EU: NEC; Provided_By: SUBCO; Component_Country_Of_Origin: Japan; ID: 2989; ShowFields: YES; Internal_Part_Number: MCD-01036; Status: Released; Package: 2.0x1.6mm; ComponentLink1Description: Datasheet; ComponentLink1URL: http://tunmcdsvn.tun.st.com/Component_Documentation_Library/Trunk/Crystal_Oscillator/NDK_NX2016SA_Series; Order_Code_Digikey: 644-1365; Order_Code_Farnell: N/A; Order_Code_RS: N/A